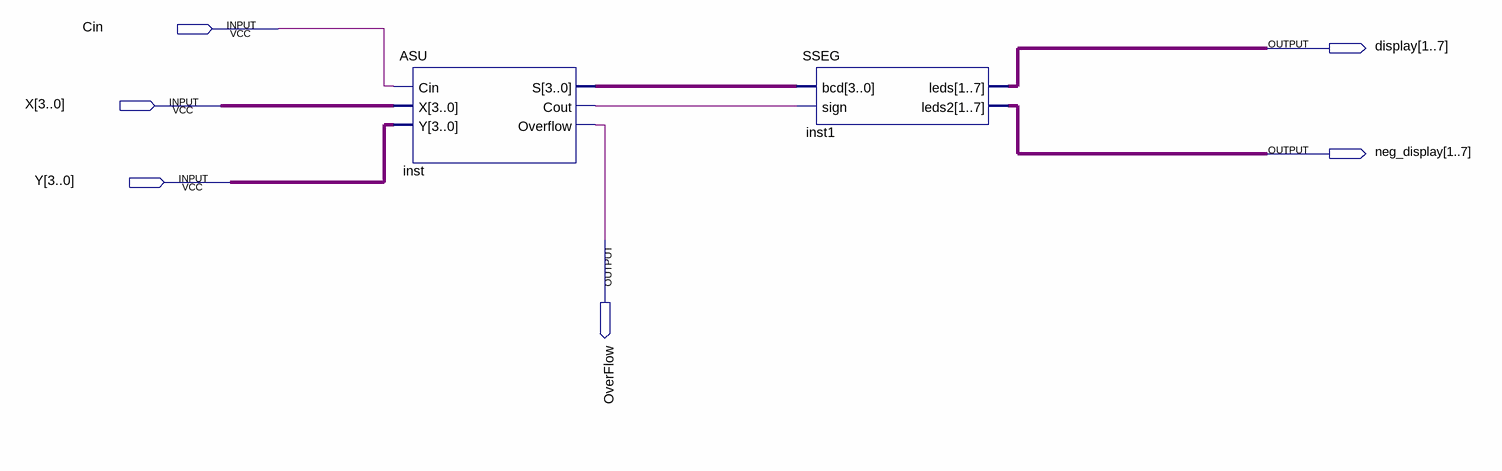
[diagram p0: schematic sheet]
// Quartus schematic CombinedASU1.bdf as structural Verilog: 2 symbols, 6 pins
module CombinedASU1 (
  input  Cin,
  input  [3:0] X,
  input  [3:0] Y,
  output [1:7] display,
  output [1:7] neg_display,
  output OverFlow
);

  wire inst_cout;
  wire [3:0] inst_s;

  ASU inst (.Cin(Cin), .X(X), .Y(Y), .S(inst_s), .Cout(inst_cout), .Overflow(OverFlow));
  SSEG inst1 (.bcd(inst_s), .sign(inst_cout), .leds(display), .leds2(neg_display));
endmodule
